# EasyEDA Pro project OPA695电流反馈运放.eprj

# Board PCB_PCB_OPA695电流反馈运放-copy_2025-07-27
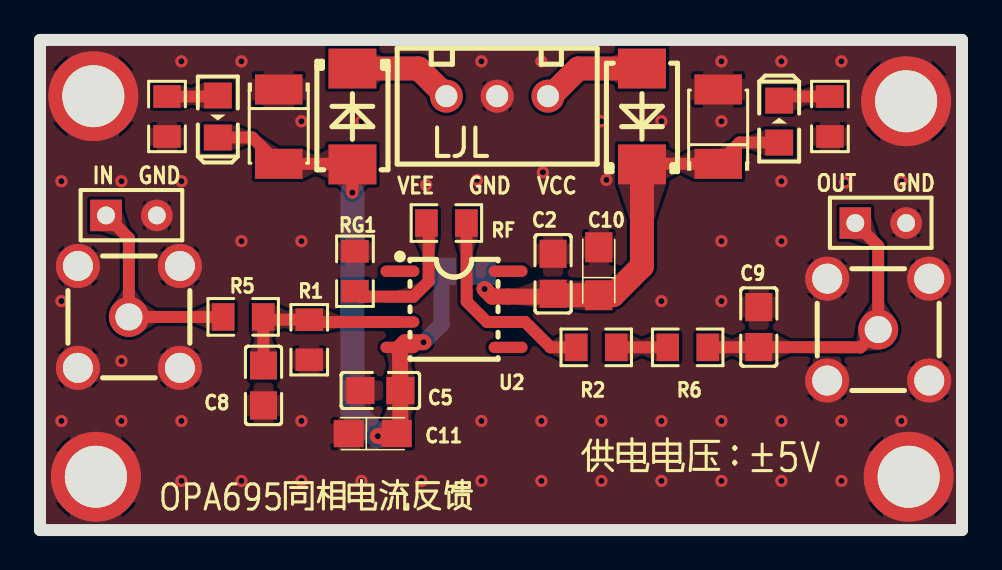
[diagram p0: board, top side]
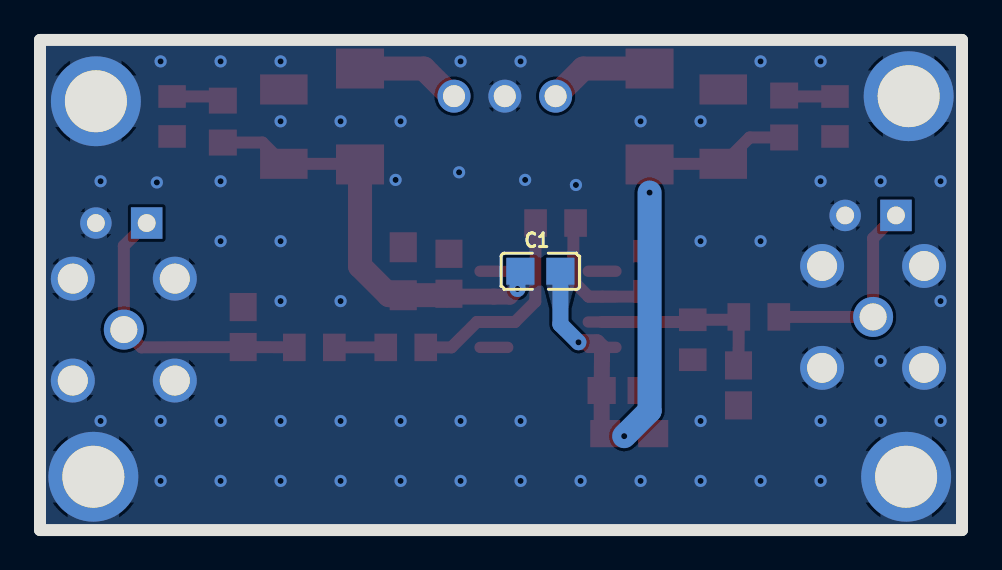
[diagram p1: board, bottom side, seen from below]

Outline 46.1 x 24.53 mm; copper layers: Top Layer, Bottom Layer. Coordinates in mm from the lower left corner of the outline.
Outline path: 0,24.53 46.1,24.53 46.1,0 0,0 0,24.53

## Design rules (mm)
via Default (default): diameter min 0.6, default 0.6, max 100.025; hole min 0.305, default 0.305, max 59.995
pour e9 uses gge7202
pour e126 uses gge7196

## Placement (name value [footprint] x y rotation side)
C1  0.01u  [C0805]  21.08 12.95 0 bottom
C2  100n  [C0805]  25.65 12.83 270 top
C3  47u  [CASE-B_3528]  33.91 20.19 90 top
C5  100n  [C0805]  17.02 6.98 180 top
C6  47u  [CASE-B_3528]  11.94 20.19 270 top
C8  0  [C0805]  11.18 7.24 90 top
C9  0  [C0805]  35.94 10.16 270 top
C10  6.8uF  [CASE-A_3216]  27.94 12.95 90 top
C11  6.8uF  [CASE-A_3216]  16.64 4.83 0 top
D1  SS34-SMB  [SMB_L4.4-W3.6-LS5.3-RD]  15.62 20.7 270 top
D2  SS34-SMB  [SMB_L4.4-W3.6-LS5.3-RD]  30.1 20.7 90 top
D3  SMA-直插  [SMA-TH_BWSMA-KE-Z001]  4.45 10.67 0 top
H1  HDR-F-2.54_1x2  [HDR-F-2.54_1X2]  4.57 15.75 0 top
H2  HDR-F-2.54_1x2  [HDR-F-2.54_1X2]  42.04 15.37 0 top
LED1  LED-0805_G  [LED0805_GREEN]  36.96 20.45 90 top
LED2  LED-0805_G  [LED0805_GREEN]  8.89 20.7 270 top
R1  50  [R0805]  13.46 9.52 90 top
R2  50  [R0805]  27.81 9.14 180 top
R5  0  [R0805]  10.16 10.67 0 top
R6  0  [R0805]  32.39 9.14 180 top
R7  3k  [R0805]  6.35 20.7 90 top
R8  3k  [R0805]  39.5 20.7 90 top
RF  402  [R0805]  20.32 15.37 0 top
RG1  56.2  [R0805]  15.75 12.95 270 top
S1  SMA-直插  [SMA-TH_BWSMA-KE-Z001]  41.91 10.03 0 top
T1  铜柱  [螺丝孔-3MM]  2.67 21.72 0 top
T2  铜柱  [螺丝孔-3MM]  2.79 2.67 0 top
T3  铜柱  [螺丝孔-3MM]  43.31 21.46 0 top
T4  铜柱  [螺丝孔-3MM]  43.43 2.67 0 top
U2  OPA695IDR  [SOIC-8_L5.0-W4.0-P1.27-LS6.1-BL]  20.7 11.05 270 top
VCCGNDVEE1  HDR-F-2.54_1x3  [CONN-TH_XH2.54_3PIN]  22.86 21.72 0 top

## Footprints (pads in the part's own frame, mm; a bottom-side part is the same pattern mirrored in y, then rotated)
C0805
  rect 1.41x1.35 smd: 1(-1,0) 2(1,0)
CASE-A_3216
  rect 1.5x1.359 smd: 1(-1.2,0) 2(1.2,0)
CASE-B_3528
  rect 1.506x2.376 smd: 1(-1.861,0) 2(1.861,0)
CONN-TH_XH2.54_3PIN
  round 1.65 hole 1.1: 1(-2.54,0) 2(0,0) 3(2.54,0)
HDR-F-2.54_1X2
  rect 1.575x1.575 hole 0.889: 1(-1.27,0)
  round 1.575 hole 0.889: 2(1.27,0)
LED0805_GREEN
  rect 1.3x1.399 smd: 1(-1.05,0) 2(1.05,0)
R0805
  rect 1.133x1.377 smd: 1(-1,0) 2(1,0)
SMA-TH_BWSMA-KE-Z001
  round 2 hole 1.35: 1(0,0)
  round 2.2 hole 1.5: 2(-2.55,2.55) 2(-2.55,-2.55) 2(2.55,2.55) 2(2.55,-2.55)
SMB_L4.4-W3.6-LS5.3-RD
  rect 2x2.4 smd: 1(-2.4,0) 2(2.4,0)
SOIC-8_L5.0-W4.0-P1.27-LS6.1-BL
  oval 0.569x1.95 smd: 1(-1.905,-2.705) 2(-0.635,-2.705) 3(0.635,-2.705) 4(1.905,-2.705) 5(1.905,2.705) 6(0.635,2.705) 7(-0.635,2.705) 8(-1.905,2.705)
螺丝孔-3MM
  round 4.5 hole 3.1: 1(0,0)

## Nets
+5V: C1.2 C2.2 C3.1 C10.1 D2.1 LED1.1 U2.7
-5V: C1.1 C5.1 C6.2 C11.2 D1.2 LED2.2 U2.4
GND: C2.1 C3.2 C5.2 C6.1 C8.1 C9.1 C10.2 C11.1 D3.2 H1.2 H2.2 R1.1 R7.1 R8.1 RG1.1 S1.2 T1.1 T2.1 T3.1 T4.1 VCCGNDVEE1.2
VIN: D3.1 H1.1 R5.1
D1_1: D1.1 VCCGNDVEE1.1
D2_2: D2.2 VCCGNDVEE1.3
R1_2: C8.2 R1.2 R5.2 U2.3
R2_1: R2.1 R6.2
R2_2: R2.2 RF.2 U2.6
R7_2: LED2.1 R7.2
R8_2: LED1.2 R8.2
RF_1: RF.1 RG1.2 U2.2
VOUT: C9.2 H2.1 R6.1 S1.1

Pads without a net: U2 1 5 8

## Via types
v1: diameter 0.61, hole 0.305, Top Layer to Bottom Layer, 58 vias

## Routing (per net, layer and track width the routed paths; a pad name or vN(x,y) marks a point on that pad's centre or on a via; arc(x,y) is an arc through that point)
+5V: length 22.1
  Top Layer w0.6: D2.1 30.13,18.33 C3.1 34.98,19.4 36.96,19.4
  Top Layer w0.8: C2.2 25.51,11.68 U2.7 22.61,11.68 v1(22.23,12.06)
  Top Layer w1.2: D2.1 30.1,13.21 28.65,11.75 C10.1 25.73,11.75 C2.2
  Bottom Layer w0.8: v1(22.23,12.06) 22.23,12.81 22.08,12.95
-5V: length 32
  Top Layer w0.6: 8.89,19.65 10.62,19.65 C6.2 15.59,18.33 D1.2 v1(15.62,16.89)
  Top Layer w0.8: v1(16.89,4.7) 17.71,4.7 C11.2 18.02,5.01 18.02,6.98 U2.4 18.25,9.4 v1(19.18,9.4)
  Bottom Layer w0.8: v1(19.18,9.4) 20.08,10.3 20.08,12.95
  Bottom Layer w1.2: v1(16.89,4.7) 15.62,5.97 v1(15.62,16.89)
GND:
  vias: v1(1.07,17.46) v1(1.07,11.46) v1(1.07,5.46) v1(4.07,17.46) v1(4.07,8.46) v1(4.07,5.46) v1(7.07,23.46) v1(7.07,17.46) v1(7.07,5.46) v1(7.07,2.46) v1(10.07,23.46) v1(10.07,14.46) v1(10.07,2.46) v1(13.07,20.46) v1(13.07,14.46) v1(13.07,5.46) v1(13.07,2.46) v1(16.07,20.46) v1(16.07,2.46) v1(19.07,2.46) v1(19.3,17.27) v1(21.84,17.53) v1(22.07,23.46) v1(22.07,5.46) v1(22.07,2.46) v1(25.07,23.46) v1(25.07,5.46) v1(25.07,2.46) v1(25.15,17.91) v1(28.07,20.46) v1(28.07,5.46) v1(28.07,2.46) v1(28.32,17.53) v1(31.07,20.46) v1(31.07,11.46) v1(31.07,5.46) v1(31.07,2.46) v1(34.07,23.46) v1(34.07,20.46) v1(34.07,14.46) v1(34.07,11.46) v1(34.07,5.46) v1(34.07,2.46) v1(37.07,23.46) v1(37.07,17.46) v1(37.07,14.46) v1(37.07,5.46) v1(37.07,2.46) v1(40.07,23.46) v1(40.07,5.46) v1(40.07,2.46) v1(40.26,17.4) v1(43.07,17.46) v1(43.07,5.46)
VIN: length 10.3
  Top Layer w0.6: R5.1 D3.1 4.45,14.61 H1.1
D1_1: length 5.3
  Top Layer w1.2: VCCGNDVEE1.1 18.94,23.1 D1.1
D2_2: length 5.3
  Top Layer w1.2: VCCGNDVEE1.3 25.53,21.72 26.91,23.1 D2.2
R1_2: length 9.4
  Top Layer w0.6: 18,10.41 13.57,10.41 13.46,10.53 11.3,10.53 R5.2 C8.2
R2_1: length 2.6
  Top Layer w0.6: 28.81,9.14 R6.2
R2_2: length 10.4
  Top Layer w0.6: R2.2 25.53,9.14 24.26,10.41 22.35,10.41 21.34,11.43 RF.2
R7_2: length 2.6
  Top Layer w0.6: 6.35,21.7 8.84,21.7 8.89,21.75
R8_2: length 2.6
  Top Layer w0.6: 36.96,21.5 37.16,21.7 39.5,21.7
RF_1: length 7.1
  Top Layer w0.6: 15.75,11.95 16.02,11.68 U2.2 18.67,11.68 19.43,12.45 19.43,15.25 RF.1
VOUT: length 14.7
  Top Layer w0.6: 40.77,15.37 41.91,14.22 S1.1 41.02,9.14 C9.2 33.39,9.14

## Copper pours and planes (outline as drawn; the poured copper is in the pictures)
GND on Top Layer: -1.27,25.91 -1.14,26.03 47.5,26.03 47.75,25.78 47.75,-1.52 47.5,-1.27 -1.27,-1.27
GND on Bottom Layer: -1.91,26.67 -1.65,26.42 48.13,26.42 48.13,-2.03 47.88,-1.78 -1.91,-1.78

Small or netless copper shapes (teardrops, artwork), in the pictures only: 49 on Top Layer, 2 on Bottom Layer

## Text on the board
Top Silkscreen Layer: IN | GND | VEE | VCC | OUT | LJL | OPA695同相电流反馈 | 供电电压：±5V
